# EAGLE design uszko (EAGLE 6.3)
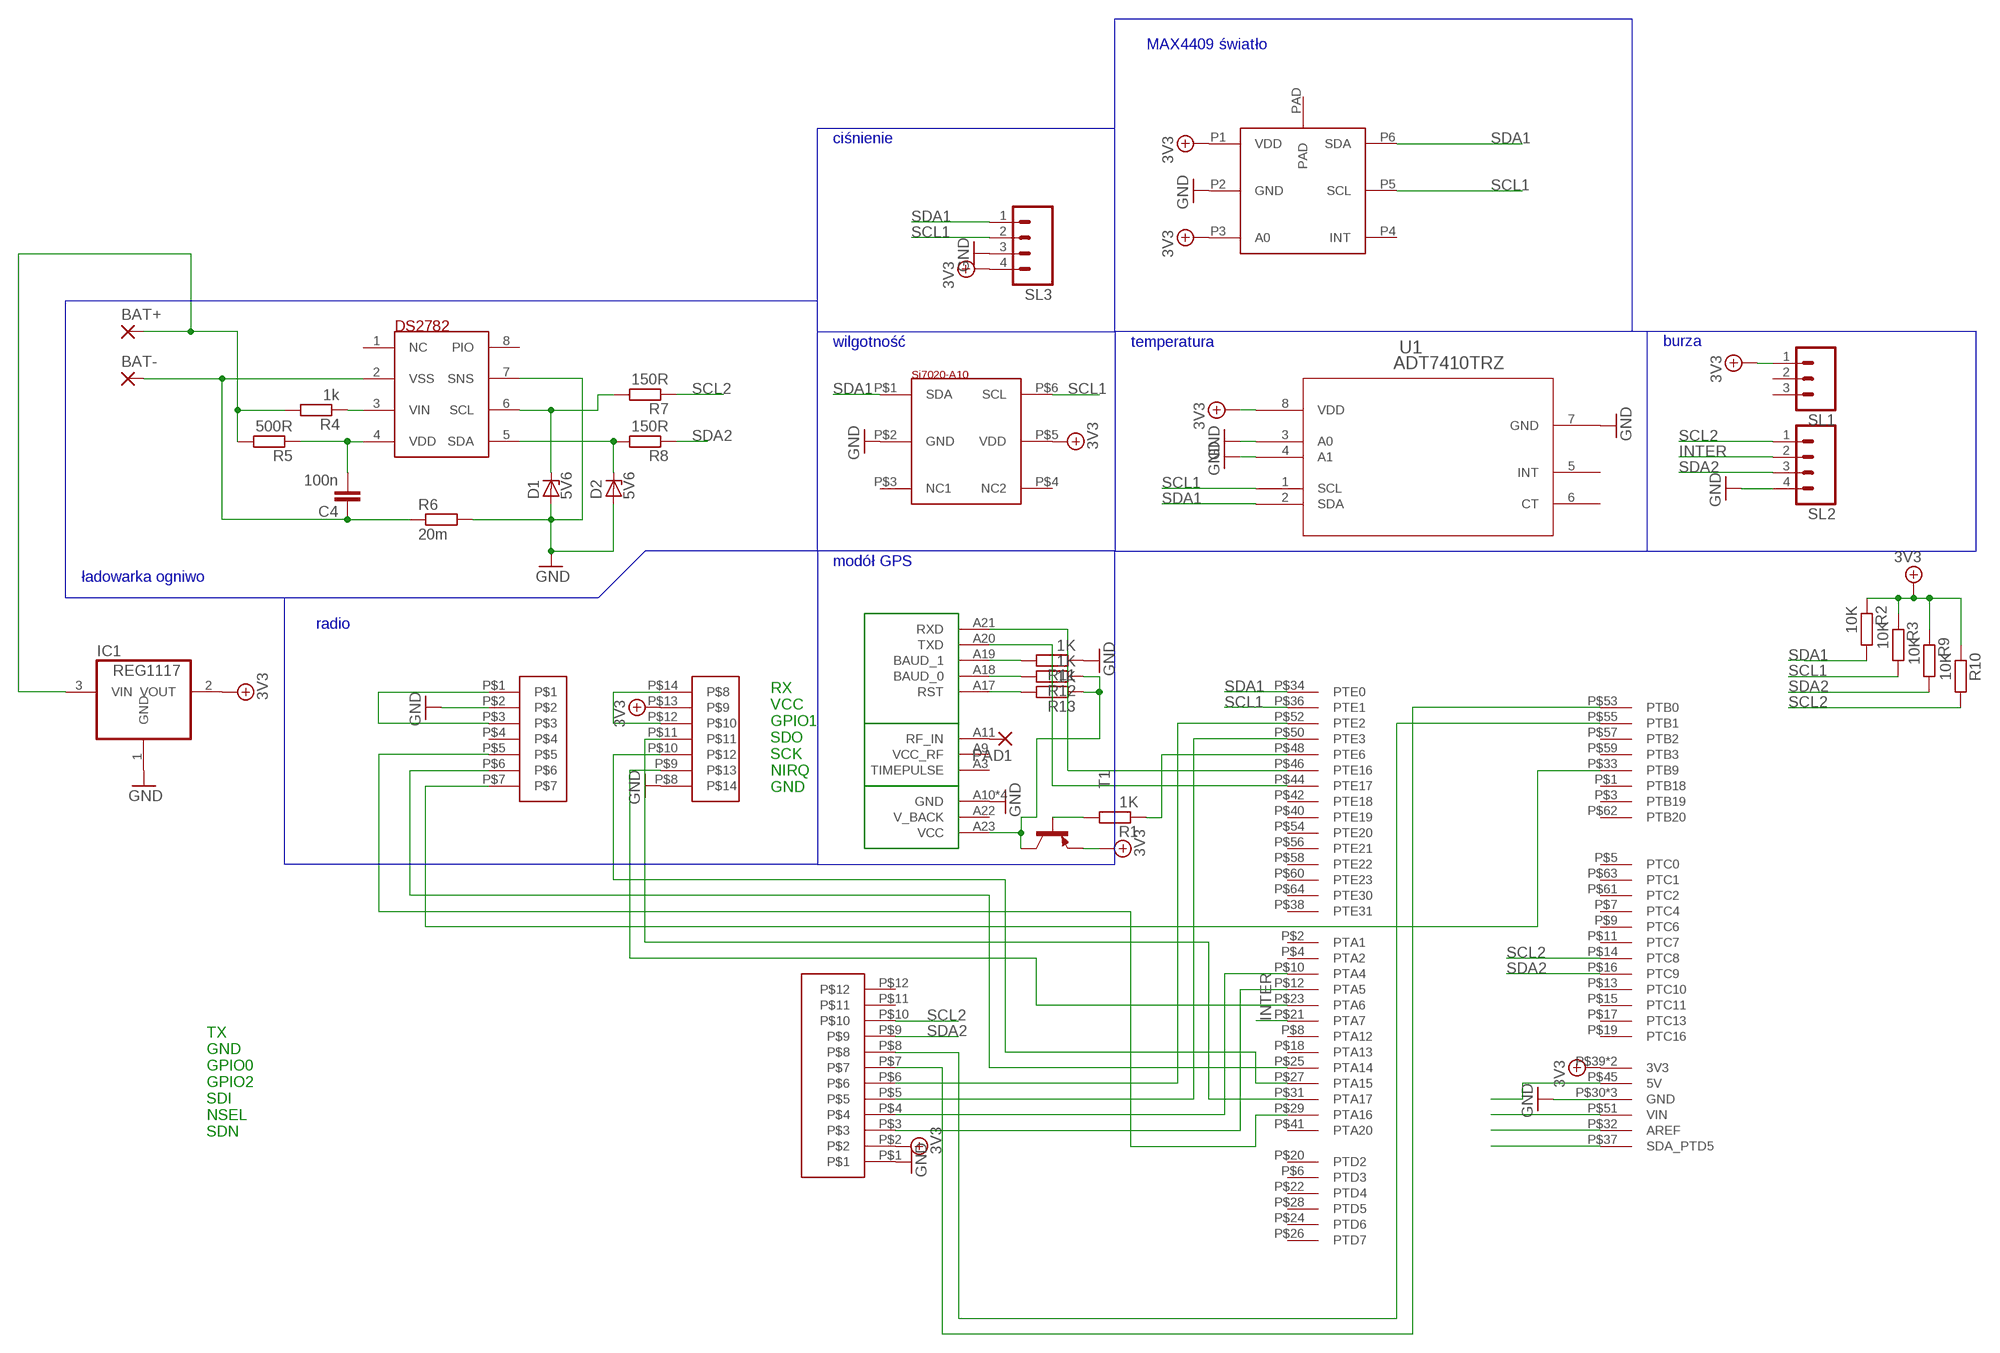
[diagram p0: schematic, sheet 1]

## Parts
BAT+  2,54/0,8  [2,54/0,8]
BAT-  2,54/0,8  [2,54/0,8]
C4  100n  C-EUC0805  [C0805]
D1  5V6  ZENER-DIODESOD80C  [SOD80C]
D2  5V6  ZENER-DIODESOD80C  [SOD80C]
IC1  REG1117  [SOT223]
PAD1  2,15/1,0  [2,15/1,0]
R1  1K  R-EU_M0805  [M0805]
R2  10K  R-EU_M0805  [M0805]
R3  10K  R-EU_M0805  [M0805]
R4  1k  R-EU_M0805  [M0805]
R5  500R  R-EU_M0805  [M0805]
R6  20m  R-EU_M1206  [M1206]
R7  150R  R-EU_M0805  [M0805]
R8  150R  R-EU_M0805  [M0805]
R9  10K  R-EU_M0805  [M0805]
R10  10K  R-EU_M0805  [M0805]
R11  1K  R-EU_M0805  [M0805]
R12  1K  R-EU_M0805  [M0805]
R13  1K  R-EU_M0805  [M0805]
SL1  M03  [03P]
SL2  M04  [04P]
SL3  M04  [04P]
T1  -PNP-SOT23-BCE  [SOT23-BCE]
U1  ADT7410TRZ  [R_8]
U$1  INTO_CON  [INTO_CON]
U$2  GTS-4E-60  [GTS-4E-60]
U$3  2X7PIN  [2X7PINCON]
U$4  SI7020-A10  [DFN6(3X3MM)]
U$5  12PINCON  [12PIN2MMCON]
U$6  MAX44006  [6OTDFN]
U$7  DS2782  [TSSOP8]

## Nets
+5V/1: IC1.2(VOUT) R2.1 R3.1 R9.1 R10.1 SL1.1 SL3.4 T1.E U1.8(VDD) U$1.P$39(3V3) U$1.P$43(3V3) U$3.P$13 U$4.P$5(VDD) U$5.P$2 U$6.P1(VDD) U$6.P3(A0) ; supply symbol labelled 3V3
GND: D1.A D2.A IC1.1(GND) R6.2 R11.1 SL2.4 SL3.3 U1.3(A0) U1.4(A1) U1.7(GND) U$1.P$30(GND) U$1.P$47(GND) U$1.P$49(GND) U$2.A10(GND) U$2.A12(GND) U$2.A13(GND) U$2.A24(GND) U$3.P$2 U$3.P$8 U$4.P$2(GND) U$5.P$1 U$6.P2(GND) U$7.7(SNS)
INTER: SL2.2 U$1.P$21(PTA7)
N$1: U$1.P$46(PTE16) U$2.A21(RXD)
N$3: U$1.P$52(PTE2) U$5.P$6
N$4: PAD1.1(P) U$2.A11(RF_IN)
N$5: U$1.P$50(PTE3) U$5.P$5
N$6: U$1.P$53(PTB0) U$5.P$7
N$7: U$1.P$55(PTB1) U$5.P$8
N$8: U$1.P$12(PTA5) U$5.P$3
N$9: U$1.P$10(PTA4) U$5.P$4
N$10: C4.2 R5.1 U$7.4(VDD)
N$11: BAT-.1(P) C4.1 R6.1 U$7.2(VSS)
N$12: R4.1 U$7.3(VIN)
N$13: D1.C R7.2 U$7.6(SCL)
N$14: D2.C R8.2 U$7.5(SDA)
N$15: U$3.P$1 U$3.P$3
N$16: U$3.P$12 U$3.P$14
N$17: U$1.P$25(PTA14) U$3.P$6
N$18: U$1.P$27(PTA15) U$3.P$10
N$19: BAT+.1(P) IC1.3(VIN) R4.2 R5.2
N$20: U$1.P$29(PTA16) U$3.P$5
N$21: U$1.P$31(PTA17) U$3.P$11
N$22: U$1.P$23(PTA6) U$3.P$9
N$23: R12.1 R13.1 T1.C U$2.A23(VCC)
N$24: R1.1 U$1.P$48(PTE6)
N$25: R1.2 T1.B
N$26: U$1.P$33(PTB9) U$3.P$7
N$27: U$1.P$44(PTE17) U$2.A20(TXD)
N$28: R12.2 U$2.A18(BAUD_0)
N$29: R11.2 U$2.A19(BAUD_1)
N$30: R13.2 U$2.A17(RST)
N$38: U$1.P$37(SDA_PTD5)
N$39: U$1.P$32(AREF)
N$40: U$1.P$51(VIN)
N$41: U$1.P$45(5V)
SCL1: R3.2 SL3.2 U1.1(SCL) U$1.P$36(PTE1) U$4.P$6(SCL) U$6.P5(SCL)
SCL2: R7.1 R10.2 SL2.1 U$1.P$14(PTC8) U$5.P$10
SDA1: R2.2 SL3.1 U1.2(SDA) U$1.P$34(PTE0) U$4.P$1(SDA) U$6.P6(SDA)
SDA2: R8.1 R9.2 SL2.3 U$1.P$16(PTC9) U$5.P$9
Unconnected: SL1.2 SL1.3 U1.5(INT) U1.6(CT) U$1.P$1(PTB18) U$1.P$2(PTA1) U$1.P$3(PTB19) U$1.P$4(PTA2) U$1.P$5(PTC0) U$1.P$6(PTD3) U$1.P$7(PTC4) U$1.P$8(PTA12) U$1.P$9(PTC6) U$1.P$11(PTC7) U$1.P$13(PTC10) U$1.P$15(PTC11) U$1.P$17(PTC13) U$1.P$18(PTA13) U$1.P$19(PTC16) U$1.P$20(PTD2) U$1.P$22(PTD4) U$1.P$24(PTD6) U$1.P$26(PTD7) U$1.P$28(PTD5) U$1.P$38(PTE31) U$1.P$40(PTE19) U$1.P$41(PTA20) U$1.P$42(PTE18) U$1.P$54(PTE20) U$1.P$56(PTE21) U$1.P$57(PTB2) U$1.P$58(PTE22) U$1.P$59(PTB3) U$1.P$60(PTE23) U$1.P$61(PTC2) U$1.P$62(PTB20) U$1.P$63(PTC1) U$1.P$64(PTE30) U$2.A3(TIMEPULSE) U$2.A9(VCC_RF) U$2.A22(V_BACK) U$3.P$4 U$4.P$3(NC1) U$4.P$4(NC2) U$5.P$11 U$5.P$12 U$6.P4(INT) U$6.PAD U$7.1(NC) U$7.8(PIO)

## Buses
B$1

## Notes on the sheet
- MAX4409 światło
- ciśnienie
- wilgotność | temperatura
- burza
- modół GPS
- ładowarka ogniwo
- radio
- RX
  VCC
  GPIO1
  SDO
  SCK
  NIRQ
  GND
- TX
  GND
  GPIO0
  GPIO2
  SDI
  NSEL
  SDN

## Library data of the parts
BAT+ BAT- = wirepad:2,54/0,8: THROUGH-HOLE PAD
C4 = rcl:C-EU: CAPACITOR, European symbol
D1 D2 = diode:ZENER-DIODE: Z-Diode
IC1 = burr-brown:REG1117: 800mA and 1A Low Dropout (LDO) Positive Regulator 1.8V, 2.5V, 2.85V, 3.3V, 5V, and Adj; MPN: REG1117; OC_FARNELL: 1097566; OC_NEWARK: 14P6981
PAD1 = wirepad:2,15/1,0: THROUGH-HOLE PAD
R1-R13 = resistor:R-EU_: RESISTOR, European symbol
SL1 = con-amp-quick:M03: AMP QUICK CONNECTOR; OC_FARNELL: unknown; OC_NEWARK: unknown
SL2 SL3 = con-amp-quick:M04: AMP QUICK CONNECTOR; OC_FARNELL: unknown; OC_NEWARK: unknown
T1 = transistor:*-PNP-: PNP Transistror
U1 = ref-packages:ADT7410TRZ
U$1 = ref-packages:INTO_CON
U$2 = ref-packages:GTS-4E-60
U$3 = ref-packages:2X7PIN
U$4 = ref-packages:SI7020-A10: I2C HUMIDITY AND TEMPERATURE SENSOR
U$5 = ref-packages:12PINCON
U$6 = MAX44006:MAX44006
U$7 = ref-packages:DS2782

## Net classes
0 default: width 0.6 mm, drill 0.8 mm, clearance 0.7 mm

## Board
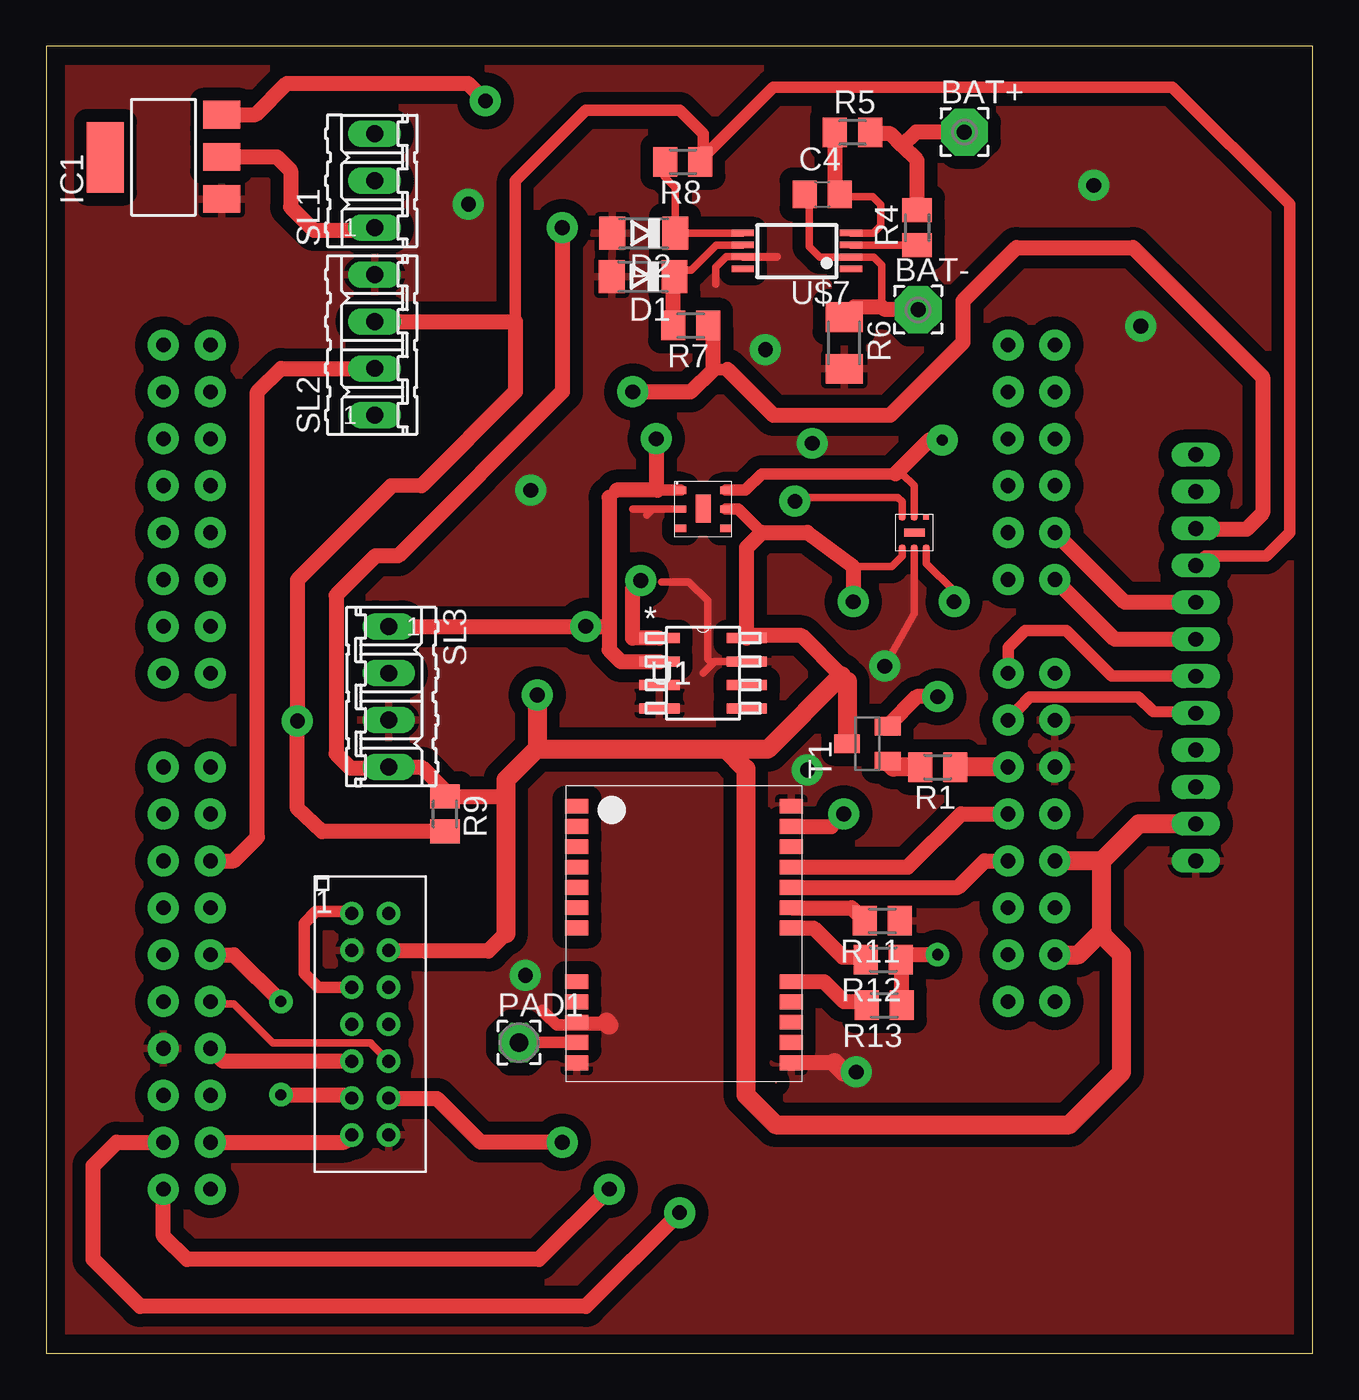
[diagram p1: board, top side]
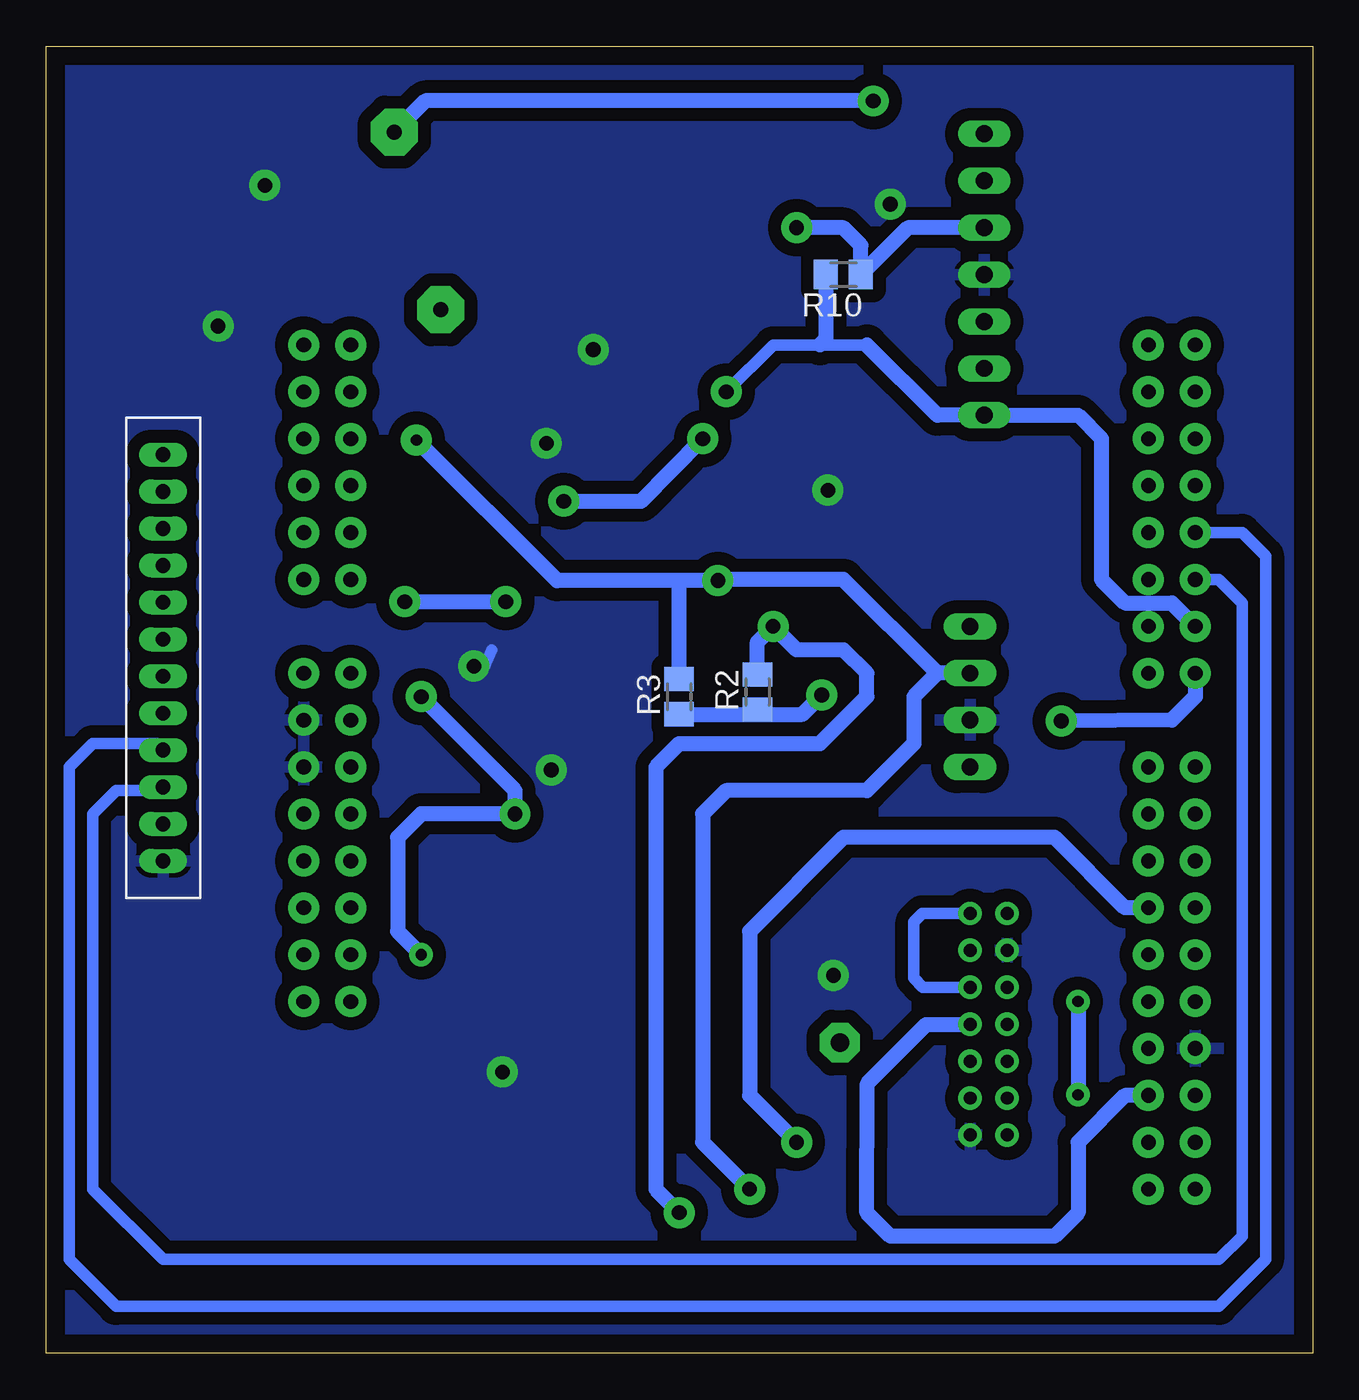
[diagram p2: board, bottom side, seen from below]

Size 68.56 x 70.79 mm. Coordinates in mm from the lower left corner, seen from the top.
Outline: 0,0 68.56,0 68.56,70.79 0,70.79 0,0
Copper layers (1*16): Top 0.035mm / dielectric 1.5mm / Bottom 0.035mm
Design rules "default": minimum track width 10mil, minimum drill 24mil, track to track 8mil, track to pad 8mil, pad to pad 8mil, via to via 8mil, smd to smd 8mil, copper to edge 40mil, drill to drill 8mil, minimum pad ring 10mil, minimum via ring 8mil, stop-mask expansion 4mil, vias tented up to drill 0mil, thermal gap 10mil

### Footprints (pad centres in the part's own frame; a part is rotated, then mirrored left to right if it is on the bottom)
2,54/0,8 = drill 0.813 pad 2.54 octagon: 1 0,0
C0805 = smd 1.3 x 1.5: 1 -0.95,0; 2 0.95,0
SOD80C = smd 1.4 x 1.8: A 1.7,0; C -1.7,0
SOT223 = smd 1.499 x 2.007: 1 -2.261,-3.15; 2 0.025,-3.15; 3 2.311,-3.15 | smd 3.81 x 2.007: 4 0,3.15
2,15/1,0 = drill 1.016 pad 2.159 octagon: 1 0,0
M0805 = smd 1.3 x 1.6: 1 -0.95,0; 2 0.95,0
M1206 = smd 1.6 x 2: 1 -1.4,0; 2 1.4,0
03P = drill 0.914 long: 1 -2.54,0; 2 0,0; 3 2.54,0
04P = drill 0.914 long: 1 -3.81,0; 2 -1.27,0; 3 1.27,0; 4 3.81,0
SOT23-BCE = smd 1 x 1.4: B -0.95,-1.1; C 0.95,-1.1; E 0,1.1
R_8 = smd 2.184 x 0.559: 1 -2.362,1.905; 2 -2.362,0.635; 3 -2.362,-0.635; 4 -2.362,-1.905; 5 2.362,-1.905; 6 2.362,-0.635; 7 2.362,0.635; 8 2.362,1.905
INTO_CON = drill 0.8 pad 1.676: P$1 -22.86,20.32; P$2 -25.4,20.32; P$3 -22.86,17.78; P$4 -25.4,17.78; P$5 -22.86,15.24; P$6 -25.4,15.24; P$7 -22.86,12.7; P$8 -25.4,12.7; P$9 -22.86,10.16; P$10 -25.4,10.16; P$11 -22.86,7.62; P$12 -25.4,7.62; P$13 -22.86,5.08; P$14 -25.4,5.08; P$15 -22.86,2.54; P$16 -25.4,2.54; P$17 -22.86,-2.54; P$18 -25.4,-2.54; P$19 -22.86,-5.08; P$20 -25.4,-5.08; P$21 -22.86,-7.62; P$22 -25.4,-7.62; P$23 -22.86,-10.16; P$24 -25.4,-10.16; P$25 -22.86,-12.7; P$26 -25.4,-12.7; P$27 -22.86,-15.24; P$28 -25.4,-15.24; P$29 -22.86,-17.78; P$30 -25.4,-17.78; P$31 -22.86,-20.32; P$32 -25.4,-20.32; P$33 -22.86,-22.86; P$34 -25.4,-22.86; P$35 -22.86,-25.4; P$36 -25.4,-25.4; P$37 22.86,-15.24; P$38 20.32,-15.24; P$39 22.86,-12.7; P$40 20.32,-12.7; P$41 22.86,-10.16; P$42 20.32,-10.16; P$43 22.86,-7.62; P$44 20.32,-7.62; P$45 22.86,-5.08; P$46 20.32,-5.08; P$47 22.86,-2.54; P$48 20.32,-2.54; P$49 22.86,0; P$50 20.32,0; P$51 22.86,2.54; P$52 20.32,2.54; P$53 22.86,7.62; P$54 20.32,7.62; P$55 22.86,10.16; P$56 20.32,10.16; P$57 22.86,12.7; P$58 20.32,12.7; P$59 22.86,15.24; P$60 20.32,15.24; P$61 22.86,17.78; P$62 20.32,17.78; P$63 22.86,20.32; P$64 20.32,20.32
GTS-4E-60 = smd 1.25 x 0.8: A1 5.5,-6.9; A2 5.5,-5.8; A3 5.5,-4.7; A4 5.5,-3.6; A5 5.5,-2.5; A6 5.5,-1.4; A7 5.5,-0.3; A8 5.5,2.6; A9 5.5,3.7; A10 5.5,4.8; A11 5.5,5.9; A12 5.5,7; A13 -6.1,7; A14 -6.1,5.9; A15 -6.1,4.8; A16 -6.1,3.7; A17 -6.1,2.6; A18 -6.1,-0.3; A19 -6.1,-1.4; A20 -6.1,-2.5; A21 -6.1,-3.6; A22 -6.1,-4.7; A23 -6.1,-5.8; A24 -6.1,-6.9
2X7PINCON = drill 0.7 pad 1.27: P$1 0,0; P$2 0,-2; P$3 0,-4; P$4 0,-6; P$5 0,-8; P$6 0,-10; P$7 0,-12; P$8 2,-12; P$9 2,-10; P$10 2,-8; P$11 2,-6; P$12 2,-4; P$13 2,-2; P$14 2,0
DFN6(3X3MM) = smd 0.6 x 0.4: P$1 -1.22,1.02; P$2 -1.22,0; P$3 -1.22,-1.047; P$4 1.22,-1.047; P$5 1.22,0; P$6 1.22,1.02 | smd 0.8 x 1.5: PAD 0.01,0.03
12PIN2MMCON = drill 0.8 long: P$1 0,0; P$2 2,0; P$3 4,0; P$4 6,0; P$5 8,0; P$6 10,0; P$7 12,0; P$8 14,0; P$9 16,0; P$10 18,0; P$11 20,0; P$12 22,0
6OTDFN = smd 0.3 x 0.3: P1 -0.65,-0.845; P2 0,-0.845; P3 0.65,-0.845; P4 0.65,0.845; P5 0,0.845; P6 -0.65,0.845 | smd 1.1 x 0.45: PAD 0.01,0
TSSOP8 = smd 1.2 x 0.35: 1 -2.925,0.975; 2 -2.925,0.325; 3 -2.925,-0.325; 4 -2.925,-0.975; 5 2.925,-0.975; 6 2.925,-0.325; 7 2.925,0.325; 8 2.925,0.975

### Placement (x,y rotation side)
BAT+  49.71,66.14 0 top
BAT-  47.2,56.51 0 top
C4  42.01,62.77 0 top
D1  32.31,58.31 180 top
D2  32.35,60.66 180 top
IC1  6.35,64.77 90 top
PAD1  25.59,16.83 0 top
R1  48.26,31.75 180 top
R2  30.05,35.81 90 bottom
R3  34.29,35.56 90 bottom
R4  47.15,60.96 90 top
R5  43.65,66.11 0 top
R6  43.2,54.71 270 top
R7  34.89,55.67 180 top
R8  34.47,64.52 180 top
R9  21.59,29.21 270 top
R10  25.4,58.42 180 bottom
R11  45.26,23.42 180 top
R12  45.31,21.33 180 top
R13  45.37,18.85 180 top
SL1  17.78,63.5 90 top
SL2  17.78,54.61 90 top
SL3  18.55,35.56 270 top
T1  44.45,33.02 90 top
U1  35.56,36.83 0 top
U$1  31.75,34.29 0 top
U$2  34.23,22.73 180 top
U$3  16.54,23.82 0 top
U$4  35.56,45.72 0 top
U$5  62.23,26.67 90 top
U$6  46.99,44.45 0 top
U$7  40.64,59.69 180 top

### Tracks (layer width: path | path; a pad name or v marks a point on that pad's centre or on a via)
+5V/1  (via drill 0.8 pad 1.68)
  Top 0.406: 46.34,43.16 46.36,43.18 | 46.36,43.18 46.36,43.59 U$6.P1 | U$6.P1 46.34,43.2 46.36,43.18 | U$6.P1 46.34,43.16 | 46.34,43.16 45.78,42.61 43.69,42.61 | U$6.P3 47.64,42.78 49.15,41.27 v49.15,40.7 | 38.05,38.86 U1.8
  Top 0.61: U$4.P$5 37.47,45.72 38.73,44.45 | 26.58,32.74 26.54,32.7
  Top 0.813: 57.07,22.78 57.15,22.86 | v43.69,40.7 43.69,42.61 41.21,44.45 38.73,44.45 37.92,43.64 U1.8 | 43.37,36.39 43.05,36.7 40.89,38.86 38.05,38.86 | 24.89,22.73 23.94,21.78 20.51,21.78 18.59,21.78 U$3.P$13 | IC1.2 12.49,64.8 13.23,64.05 13.23,62.08 14.49,60.82 17.64,60.82 SL1.1 | 24.89,30.48 24.57,30.16 R9.1 21.59,30.48 20.32,31.75 SL3.4 18.5,31.7 16.46,31.7 15.7,32.46 15.7,41.06 17.82,43.18 19.05,43.18 27.94,52.07 v27.94,60.96
  Top 1.016: U$5.P$2 59.15,28.67 57.15,26.67 | 57.15,26.67 U$1.P$43 | U$1.P$39 55.88,21.59 57.07,22.78 58.22,21.62 58.22,15.22 55.39,12.38 39.48,12.38 37.88,13.99 37.88,31.65 36.83,32.7 | 57.15,22.86 57.15,26.67 | 36.83,32.7 39.05,32.7 43.05,36.7 | 36.83,32.7 26.54,32.7 24.89,31.05 24.89,30.48 24.89,22.73 | v26.58,35.65 26.58,32.74 | 43.37,36.39 43.37,33.04 T1.E
  Bottom 0.813: v49.15,40.7 v43.69,40.7 | R3.1 29.63,34.61 | 29.63,34.61 27.62,34.61 v26.58,35.65 | R2.1 29.87,34.86 29.63,34.61 | SL1.1 21.91,60.96 R10.1 24.45,60.01 25.4,60.96 v27.94,60.96
GND  (via drill 0.8 pad 1.68)
  Top 0.406: 31.75,45.72 U$4.P$2 32.83,45.72 32.51,45.4 | U$6.P2 46.99,40.07 v45.4,37.21 | U1.7 36.2,37.46 36.07,37.34 | 36.07,37.34 35.56,36.83 | 33.34,41.78 34.8,41.78 35.81,40.77 35.81,37.59 36.07,37.34 | U$7.7 39.56,59.36 39.58,59.38 36.83,59.38 36.25,58.81 36.25,57.91 36.24,57.9
  Top 0.61: U$2.A10 30.33,17.93 | 30.48,17.78 27.65,17.78 26.86,18.57
  Top 0.813: 42.69,15.73 U$2.A13
  Top 1.016: 42.69,15.73 43.18,15.24 | 30.33,17.93 30.48,17.78
  Bottom 0.61: v45.4,37.21 44.83,37.21 44.45,38.1
  other vias: 41.48,49.28 59.26,55.63 38.94,54.36 56.72,63.25 43.86,15.23 22.86,62.23 41.21,31.59 26.24,46.74 25.94,20.47
  pour Top: -15.24,-2.54 154.94,-1.27 154.94,100.33 -15.24,99.06
  pour Bottom: -1.27,0 68.58,0 68.58,71.12 -1.27,71.12
INTER
  Top 0.813: U$1.P$21 10.16,26.67 11.43,27.94 11.43,52.07 12.7,53.34 SL2.2
N$1
  Top 0.813: U$2.A21 46.65,26.33 49.53,29.21 U$1.P$46
N$3
  Top 0.61: U$5.P$6 57.69,36.67 55.22,39.14 53,39.14 52.08,38.22 52.08,36.84 U$1.P$52
N$4
  Top 0.61: U$2.A11 PAD1.1
N$5
  Top 0.61: U$1.P$50 52.07,34.33 53.24,35.55 59.13,35.55 59.93,34.75 62.2,34.7 U$5.P$5
N$6
  Top 0.813: U$5.P$7 57.85,38.67 U$1.P$53
N$7
  Top 0.813: U$5.P$8 58.39,40.67 U$1.P$55
N$8
  Bottom 0.61: U$1.P$12 5.08,41.91 3.81,40.64 3.81,6.35 5.08,5.08 62.23,5.08 66.04,8.89 66.04,29.21 64.77,30.48 62.42,30.48 U$5.P$3
N$9
  Bottom 0.61: U$1.P$10 3.81,44.45 2.54,43.18 2.54,5.08 5.08,2.54 64.77,2.54 67.31,5.08 67.31,31.75 66.04,33.02 62.58,33.02 U$5.P$4
N$10
  Top 0.406: 42.7,63.03 C4.2 43.09,62.64 44.75,62.64 45.19,62.21 45.19,61.07 44.78,60.66 U$7.4
  Top 0.813: R5.1 42.7,63.03
N$11
  Top 0.406: C4.1 41.32,62.51 41.32,59.92 41.88,59.36 U$7.2 44.81,59.36 45.23,58.94 45.23,56.66 45.34,56.55 | 47.17,56.55 BAT-.1
  Top 0.813: 45.34,56.55 47.17,56.55 | 45.23,56.66 43.74,56.66 R6.1
N$12
  Top 0.406: U$7.3 R4.1
N$13
  Top 0.406: U$7.6 36.29,60.01 35.35,59.08 | 35.35,59.08 | 35.35,59.08 34.93,58.66 34.36,58.66 D1.C 33.94,58.23
  Top 0.813: R7.2 33.94,58.23
N$14
  Top 0.406: U$7.5 D2.C | D2.C | D2.C 34.05,63.12 33.46,63.71 33.46,64.46 R8.2
N$15
  Top 0.406: 16.44,23.93 U$3.P$1
  Top 0.61: U$3.P$3 14.74,19.81 13.96,20.59 13.96,23.28 14.61,23.93 16.44,23.93
N$16
  Bottom 0.406: U$3.P$14
  Bottom 0.61: U$3.P$12 21.09,19.82 21.59,20.32 21.59,23.36 21.13,23.82 U$3.P$14
N$17  (via drill 0.6 pad 1.27)
  Top 0.813: U$1.P$25 10.16,21.59 v12.7,19.05 | v12.7,14 16.36,14 U$3.P$6
  Bottom 0.813: v12.7,19.05 v12.7,14.01 v12.7,14
N$18
  Top 0.406: U$3.P$10 17.66,16.7 17.66,16.71 17.56,16.81 12.26,16.81 10.15,18.92 9.02,18.92 U$1.P$27
N$19  (via drill 0.8 pad 1.68)
  Top 0.406: 44.67,66.04 R5.2
  Top 0.813: R4.2 47.15,64.61 46.36,65.41 | 46.36,65.41 45.72,66.04 44.67,66.04 | BAT+.1 47.09,66.14 46.36,65.41 | IC1.3 11.33,67.08 13.03,68.78 22.83,68.78 v23.78,67.82
  Bottom 0.813: v23.78,67.82 48.03,67.82 BAT+.1
N$20
  Top 0.813: U$3.P$5 9.58,15.82 U$1.P$29
N$21
  Bottom 0.813: U$1.P$31 10.16,13.97 12.7,11.43 12.7,7.62 13.97,6.35 22.86,6.35 24.13,7.62 24.1,14.62 22.83,15.89 22.22,16.51 20.92,17.81 18.56,17.81 U$3.P$11
N$22  (via drill 0.8 pad 1.68)
  Top 0.813: v27.94,11.43 23.52,11.43 21.17,13.78 18.58,13.78 U$3.P$9
  Bottom 0.813: U$1.P$23 10.16,24.13 13.97,27.94 25.4,27.94 30.48,22.86 30.48,13.97 v27.94,11.43
N$23  (via drill 0.6 pad 1.27, 0.8 pad 1.68)
  Top 0.61: 42.5,28.53 v43.18,29.21
  Top 0.813: U$2.A23 42.5,28.53 | v48.26,35.56 47.14,35.56 T1.C | R13.1 46.32,21.27 R12.1 46.52,21.59 v48.26,21.59
  Bottom 0.813: v48.26,35.56 43.18,30.48 v43.18,29.21 48.26,29.21 49.53,27.94 49.53,22.86 v48.26,21.59
N$24
  Top 1.016: U$1.P$48 R1.1
N$25
  Top 1.016: R1.2 45.87,31.75 T1.B
N$26
  Top 0.813: U$1.P$33 16.15,11.43 U$3.P$7
N$27
  Top 0.813: U$2.A20 49.36,25.23 50.8,26.67 U$1.P$44
N$28
  Top 0.813: U$2.A18 41.55,23.03 43.12,21.46 44.23,21.46 R12.2
N$29
  Top 0.813: U$2.A19 43.6,24.13 R11.2
N$30
  Top 0.813: U$2.A17 42.1,20.13 43.18,19.05 44.22,19.05 R13.2
SCL1  (via drill 0.6 pad 1.68, 0.8 pad 1.68)
  Top 0.406: U$6.P5 46.99,46.99 46.36,47.62 45.97,47.62
  Top 0.61: 45.97,47.62 38.73,47.62 37.85,46.74 U$4.P$6
  Top 0.813: U1.1 31.75,38.73 31.75,41.4 v32.2,41.85 | v48.51,49.47 47.82,49.47 45.97,47.62 | v30.48,8.89 26.67,5.08 7.62,5.08 6.35,6.35 U$1.P$36
  Bottom 0.406: v32.2,41.85 31.81,41.85
  Bottom 0.813: 34.29,41.85 v32.2,41.85 32.13,41.91 25.4,41.91 20.32,36.83 | 34.29,41.85 40.89,41.85 v48.51,49.47 | R3.2 34.29,41.85 | SL3.2 20.32,36.83 | 20.32,36.83 21.59,35.56 21.59,33.02 24.13,30.48 31.75,30.48 33.02,29.21 33.02,11.43 v30.48,8.89
SCL2  (via drill 0.8 pad 1.68)
  Top 0.61: 36.11,55.4 R7.1 | 36.11,53.28 36.89,53.28 | 62.28,44.62 U$5.P$10
  Top 0.813: v31.75,52.07 34.89,52.07 36.11,53.28 36.11,55.4 | 36.89,53.28 39.37,50.8 45.68,50.8 49.64,54.76 49.64,57 52.52,59.88 58.85,59.88 65.86,52.87 65.86,45.5 64.97,44.62 62.28,44.62
  Bottom 0.61: 24.13,54.61 26.67,54.61 29.21,54.61 v31.75,52.07
  Bottom 0.813: R10.2 26.35,54.93 26.67,54.61 | 24.13,54.61 20.32,50.8 SL2.1 12.7,50.8 11.43,49.53 11.43,41.91 10.16,40.64 7.62,40.64 U$1.P$14
SDA1  (via drill 0.8 pad 1.68)
  Top 0.406: 30.86,46.74 30.48,46.35 | U$6.P6 46.34,46.11 46.1,46.35 46.08,46.35 44.99,46.35 40.88,46.36 v40.53,46.14 | 33.02,46.8 33.08,46.74
  Top 0.61: U$4.P$1 33.08,46.74
  Top 0.813: 33.08,46.74 30.86,46.74 | 30.48,46.35 30.48,39.37 | 30.48,39.37 30.48,38.1 31.11,37.46 U1.2 | v33.02,49.53 33.02,46.8 | 30.48,39.37 v29.21,39.37 SL3.1 | v34.29,7.62 29.21,2.54 5.08,2.54 2.54,5.08 2.54,10.16 3.81,11.43 U$1.P$34
  Bottom 0.813: v40.53,46.14 36.35,46.14 v33.02,49.53 | R2.2 30.05,38.53 v29.21,39.37 27.94,38.1 25.4,38.1 24.13,36.83 24.13,35.56 26.67,33.02 34.29,33.02 35.56,31.75 35.56,8.89 v34.29,7.62
SDA2  (via drill 0.8 pad 1.68)
  Top 0.61: 25.4,55.88 25.4,63.5 29.21,67.31 34.29,67.31 35.56,66.04 35.56,64.77 | R8.1 35.56,64.66 35.56,64.77 | 35.56,64.77 39.37,68.58 60.96,68.58 67.31,62.23 67.31,44.45 66.04,43.18 62.74,43.18 U$5.P$9
  Top 0.813: SL2.3 25.4,55.88 25.4,52.07 20.32,46.99 18.68,46.97 13.6,41.89 v13.6,34.25 13.6,29.5 14.92,28.26 R9.2
  Bottom 0.813: U$1.P$16 6.35,35.56 7.62,34.29 v13.6,34.25